# EAGLE design in12a (EAGLE 9.6.2)
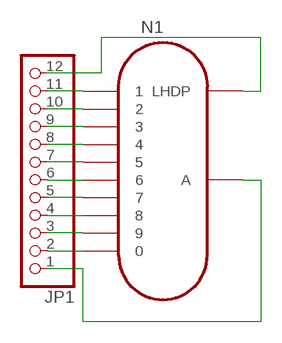
[diagram p0: schematic, sheet 1]

## Parts
JP1  PINHD-1X12  [1X12]
N1  IN-12B  [IN-12]

## Nets
N$1: JP1.2 N1.0
N$2: JP1.3 N1.9
N$3: JP1.4 N1.8
N$4: JP1.5 N1.7
N$5: JP1.6 N1.6
N$6: JP1.7 N1.5
N$7: JP1.8 N1.4
N$8: JP1.9 N1.3
N$9: JP1.10 N1.2
N$10: JP1.11 N1.1
N$11: JP1.1 N1.A
N$12: JP1.12 N1.LHDP

## Library data of the parts
JP1 = pinhead:PINHD-1X12: PIN HEADER
N1 = russian-nixies:IN-12B: IN-12B: medium numeric topview nixie tube

## Board
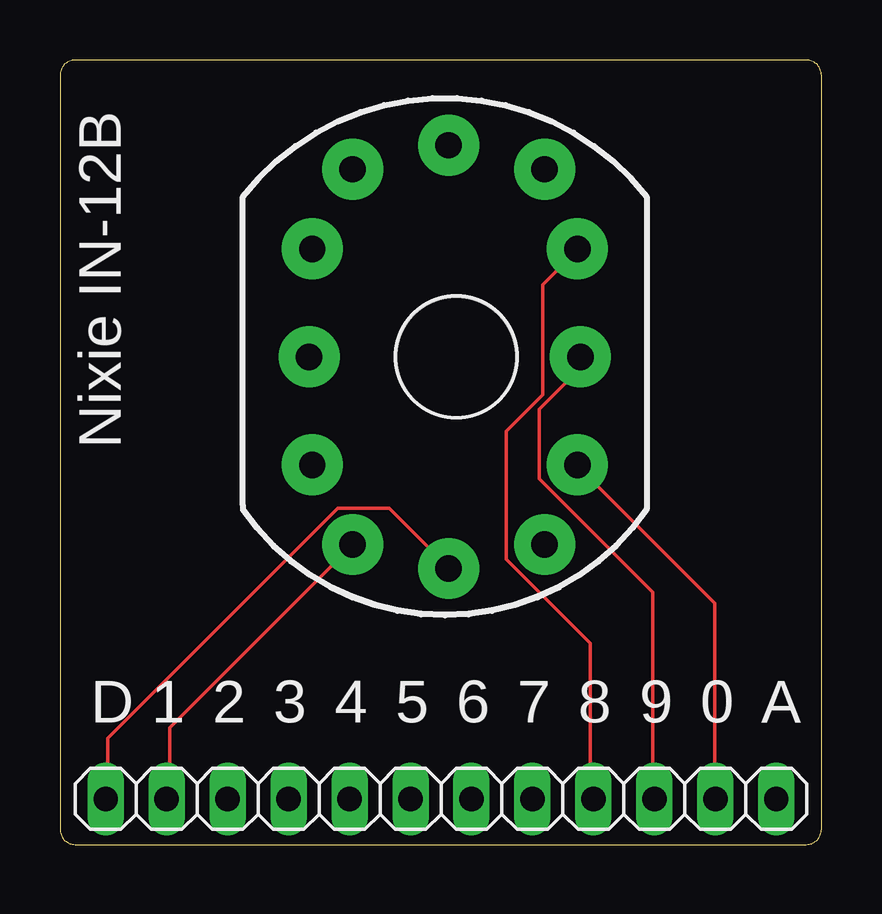
[diagram p1: board, top side]
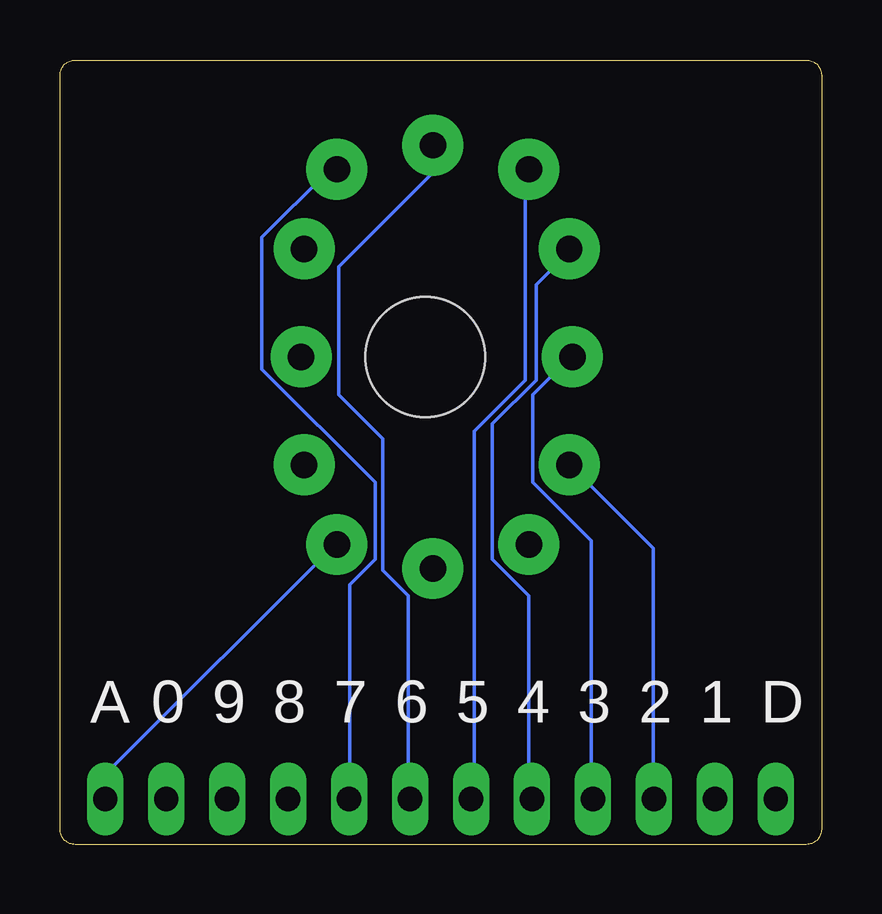
[diagram p2: board, bottom side, seen from below]

Size 31.73 x 32.69 mm. Coordinates in mm from the lower left corner, seen from the top.
Outline: 0,32.05 0,0.64 arc90 0.64,0 31.09,0 arc90 31.73,0.64 31.73,32.05 arc90 31.09,32.69 0.64,32.69 arc90 0,32.05
Copper layers (1*16): Top 0.035mm / dielectric 1.5mm / Bottom 0.035mm
Design rules "default": minimum track width 6mil, minimum drill 0.35mm, track to track 6mil, track to pad 6mil, pad to pad 6mil, via to via 6mil, smd to smd 6mil, copper to edge 40mil, drill to drill 6mil, minimum pad ring 10mil, minimum via ring 8mil, stop-mask expansion 4mil, vias tented up to drill 0mil, thermal gap 10mil

### Footprints (pad centres in the part's own frame; a part is rotated, then mirrored left to right if it is on the bottom)
1X12 = drill 1.016 long: 1 -13.97,0; 2 -11.43,0; 3 -8.89,0; 4 -6.35,0; 5 -3.81,0; 6 -1.27,0; 7 1.27,0; 8 3.81,0; 9 6.35,0; 10 8.89,0; 11 11.43,0; 12 13.97,0
IN-12 = drill 1.1 pad 2.54: 0 5.048,-4.5; 1 -4.317,-7.817; 2 -6,-4.5; 3 -6.127,0; 4 -6,4.5; 5 -4.317,7.817; 6 -0.318,8.818; 7 3.683,7.817; 8 5.048,4.5; 9 5.175,0; A 3.683,-7.817; LHDP -0.318,-8.818 | hole 5: 0,0

### Placement (x,y rotation side)
JP1  15.88,1.91 180 top
N1  16.51,20.32 0 top

### Tracks (layer width: path | path; a pad name or v marks a point on that pad's centre or on a via)
N$1
  Top 0.152: JP1.2 27.28,1.98 27.28,10.06 21.64,15.7 N1.0
N$2
  Top 0.152: JP1.3 24.69,1.98 24.69,10.52 19.96,15.24 19.96,18.14 21.64,19.81 21.64,20.27 N1.9
N$3
  Top 0.152: JP1.4 22.1,1.98 22.1,8.38 18.59,11.89 18.59,17.22 20.12,18.75 20.12,23.32 21.49,24.69 N1.8
N$4
  Bottom 0.152: JP1.5 19.66,1.98 19.66,10.82 18.59,11.89 18.59,15.09 23.32,19.81 23.32,25.3 20.57,28.04 20.27,28.04 N1.7
N$5
  Bottom 0.152: JP1.6 17.22,1.98 17.22,10.36 18.29,11.43 18.29,16.92 20.12,18.75 20.12,24.08 16.31,27.89 16.31,29.11 N1.6
N$6
  Bottom 0.152: JP1.7 14.48,1.98 14.48,17.22 12.34,19.36 12.34,28.04 N1.5
N$7
  Bottom 0.152: JP1.8 12.19,1.98 12.19,10.36 13.72,11.89 13.72,17.53 11.89,19.36 11.89,23.32 10.52,24.69 N1.4
N$8
  Bottom 0.152: JP1.9 9.6,1.98 9.6,12.65 12.04,15.09 12.04,18.75 10.52,20.27 N1.3
N$9
  Bottom 0.152: JP1.10 7.01,1.98 7.01,12.34 10.36,15.7 N1.2
N$10
  Top 0.152: JP1.11 4.57,1.98 4.57,4.88 N1.1
N$11
  Bottom 0.152: JP1.1 29.72,1.98 29.72,3.05 20.27,12.5 N1.A
N$12
  Top 0.152: JP1.12 1.98,1.98 1.98,4.42 11.58,14.02 13.72,14.02 16.15,11.58 N1.LHDP

### Text on the board
tPlace: Nixie IN-12B | D | 1 | 2 | 3 | 4 | 5 | 6 | 7 | 8 | 9 | 0 | A
bPlace: D | 1 | 2 | 3 | 4 | 5 | 6 | 7 | 8 | 9 | 0 | A